# Altium schematic sheet [01] - MCU.SchDoc: =ProjectName
size A4; CheckedBy: DatNB; Author: Ven; CompanyName: Nacentech; Organization: IMET
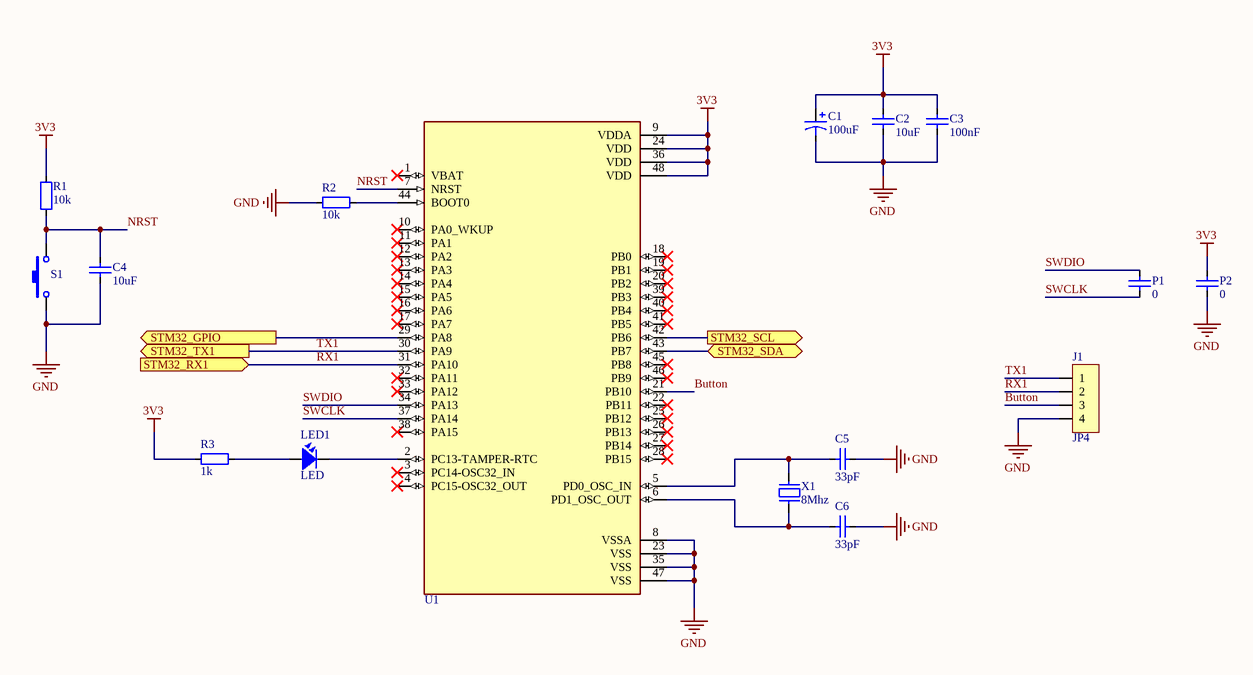
[diagram p0: [01] - MCU.SchDoc]

## Parts
C1  100uF  [CAP_7343]
C2  10uF  [CAP_0603]
C3  100nF  [CAP_0603]
C4  10uF  [CAP_0603]
C5  33pF  [CAP_0603]
C6  33pF  [CAP_0603]
J1  JP4  [JP4-C1T]
LED1  LED  [LED-0805-Orange]
P1  0  [CAP_0805]
P2  0  [CAP_0805]
R1  10k  [RES-SMD-0603]
R2  10k  [RES-SMD-0603]
R3  1k  [RES-SMD-0603]
S1  SW-SMD  [SW 3x2x4]  (value not drawn)
U1  STM32  [LQFP 48]  (value not drawn)
X1  8Mhz  [XTAL 5032 SMD]

## Ports
STM32_GPIO (out), STM32_RX1 (in), STM32_SCL (out), STM32_SDA (bidir), STM32_TX1 (out)

## Nets
3V3: C1.1 C2.2 C3.2 P2.2 R1.2 R3.1 U1.9(VDDA) U1.24(VDD) U1.36(VDD) U1.48(VDD)
GND: C1.2 C2.1 C3.1 C4.1 C5.2 C6.2 J1.4 P2.1 R2.1 S1.1 U1.8(VSSA) U1.23(VSS) U1.35(VSS) U1.47(VSS)
Button: J1.3 U1.21(PB10)
NRST: C4.2 R1.1 S1.2 U1.7(NRST)
RX1: J1.2 U1.31(PA10) ; port STM32_RX1
STM32_GPIO: U1.29(PA8) ; port STM32_GPIO
STM32_SCL: U1.42(PB6) ; port STM32_SCL
STM32_SDA: U1.43(PB7) ; port STM32_SDA
SWCLK: P1.1 U1.37(PA14)
SWDIO: P1.2 U1.34(PA13)
TX1: J1.1 U1.30(PA9) ; port STM32_TX1
NetC5_1: C5.1 U1.5(PD0_OSC_IN) X1.2
NetC6_1: C6.1 U1.6(PD1_OSC_OUT) X1.1
NetLED1_1: LED1.1 R3.2
NetLED1_2: LED1.2 U1.2(PC13-TAMPER-RTC)
NetR2_2: R2.2 U1.44(BOOT0)

Not connected (* = marked no-connect by the designer): U1 1(VBAT)* 3(PC14-OSC32_IN)* 4(PC15-OSC32_OUT)* 10(PA0_WKUP)* 11(PA1)* 12(PA2)* 13(PA3)* 14(PA4)* 15(PA5)* 16(PA6)* 17(PA7)* 18(PB0)* 19(PB1)* 20(PB2)* 22(PB11)* 25(PB12)* 26(PB13)* 27(PB14)* 28(PB15)* 32(PA11)* 33(PA12)* 38(PA15)* 39(PB3)* 40(PB4)* 41(PB5)* 45(PB8)* 46(PB9)*

## Notes on the sheet
- Project:
- Page Contents:
- Size:
- Date:
- A4
- Checked by:
- Time:
- Revision:
- Sheet
- of
- File:

## Library data of the parts
C1 = Cap Pol: Tantalum; Published: 8-Jun-2000; LatestRevisionDate: 17-Jul-2002; LatestRevisionNote: Re-released for DXP Platform.; PackageReference: POLAR0.8; Publisher: Altium Limited
C2-C6 = CapSMD: Capacitor; Value: 33p; Published: 8-Jun-2000; LatestRevisionDate: 17-Jul-2002; LatestRevisionNote: Re-released for DXP Platform.; PackageReference: RAD-0.3; Publisher: Altium Limited
J1 = JP4: WR-PHD 2.54 mm Angled Socket Header; Manufacturer: W¨¹rth Elektronik eiSos GmbH; partNo: 613004143121; ComponentLink1 Description: Manufacturer; ComponentLink2 Description: Datasheet; NoPins: 04; Created Date: 29 March 2013; ComponentLink1URL: http://www.we-online.com; ComponentLink2URL: http://katalog.we-online.de/em/datasheet/6130xx143121.pdf; Created by: Karrer Zheng
LED1 = LED: LED Single colour Green and Red; Value: LED 3 ly Single Colour
P1 P2 = CapSMD: Pad; Value: 33p; Published: 8-Jun-2000; LatestRevisionDate: 17-Jul-2002; LatestRevisionNote: Re-released for DXP Platform.; PackageReference: RAD-0.3; Publisher: Altium Limited
R1-R3 = Resistor - SMD: Resistor; Manufacturer: Generic Components; Class: Passive; Published: 08/06/2000; Publisher: Altium Hobart Technology Centre
S1 = SW-SMD: Switch; Published: 24-Mar-1999; LatestRevisionDate: 17-Jul-2002; LatestRevisionNote: Re-released for DXP Platform.; PackageReference: SPST-2; Publisher: Altium Limited
U1 = STM32F103C8T6: STM32 ARM-based 32-bit MCU with 64 Kbytes Flash, 64-pin LQFP, Industrial Temperature
X1 = XT2: Crystal For all Crystal 2pin.; Value: 4Mhz